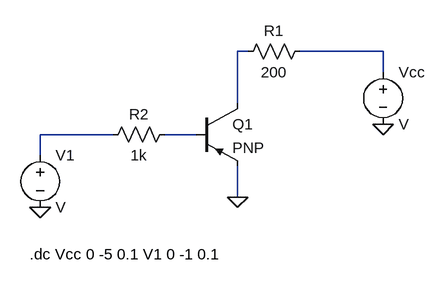
[diagram p0: schematic pnp_IV.asc]
pnp_IV.asc, the LTspice schematic file:
Version 4
SHEET 1 880 680
WIRE 368 -16 352 -16
WIRE 576 -16 448 -16
WIRE 576 16 576 -16
WIRE 352 64 352 -16
WIRE 160 112 48 112
WIRE 288 112 240 112
WIRE 48 144 48 112
WIRE 352 208 352 160
FLAG 352 208 0
FLAG 48 224 0
FLAG 576 96 0
SYMBOL voltage 48 128 R0
SYMATTR InstName V1
SYMBOL voltage 576 0 R0
SYMATTR InstName Vcc
SYMBOL res 464 -32 R90
WINDOW 0 0 56 VBottom 2
WINDOW 3 32 56 VTop 2
SYMATTR InstName R1
SYMATTR Value 200
SYMBOL res 256 96 R90
WINDOW 0 0 56 VBottom 2
WINDOW 3 32 56 VTop 2
SYMATTR InstName R2
SYMATTR Value 1k
SYMBOL pnp 288 64 R0
SYMATTR InstName Q1
TEXT 32 296 Left 2 !.dc Vcc 0 -5 0.1 V1 0 -1 0.1

The netlist it stands for:
* pnp_IV.asc
V1 N003 0 V
Vcc N002 0 V
R1 N002 N001 200
R2 N004 N003 1k
Q1 N001 N004 0 0 PNP
.model NPN NPN
.model PNP PNP
.lib standard.bjt
.dc Vcc 0 -5 0.1 V1 0 -1 0.1
.backanno
.end